# EAGLE schematic AVR_Roller_PCB_7x (EAGLE 8.0.1)
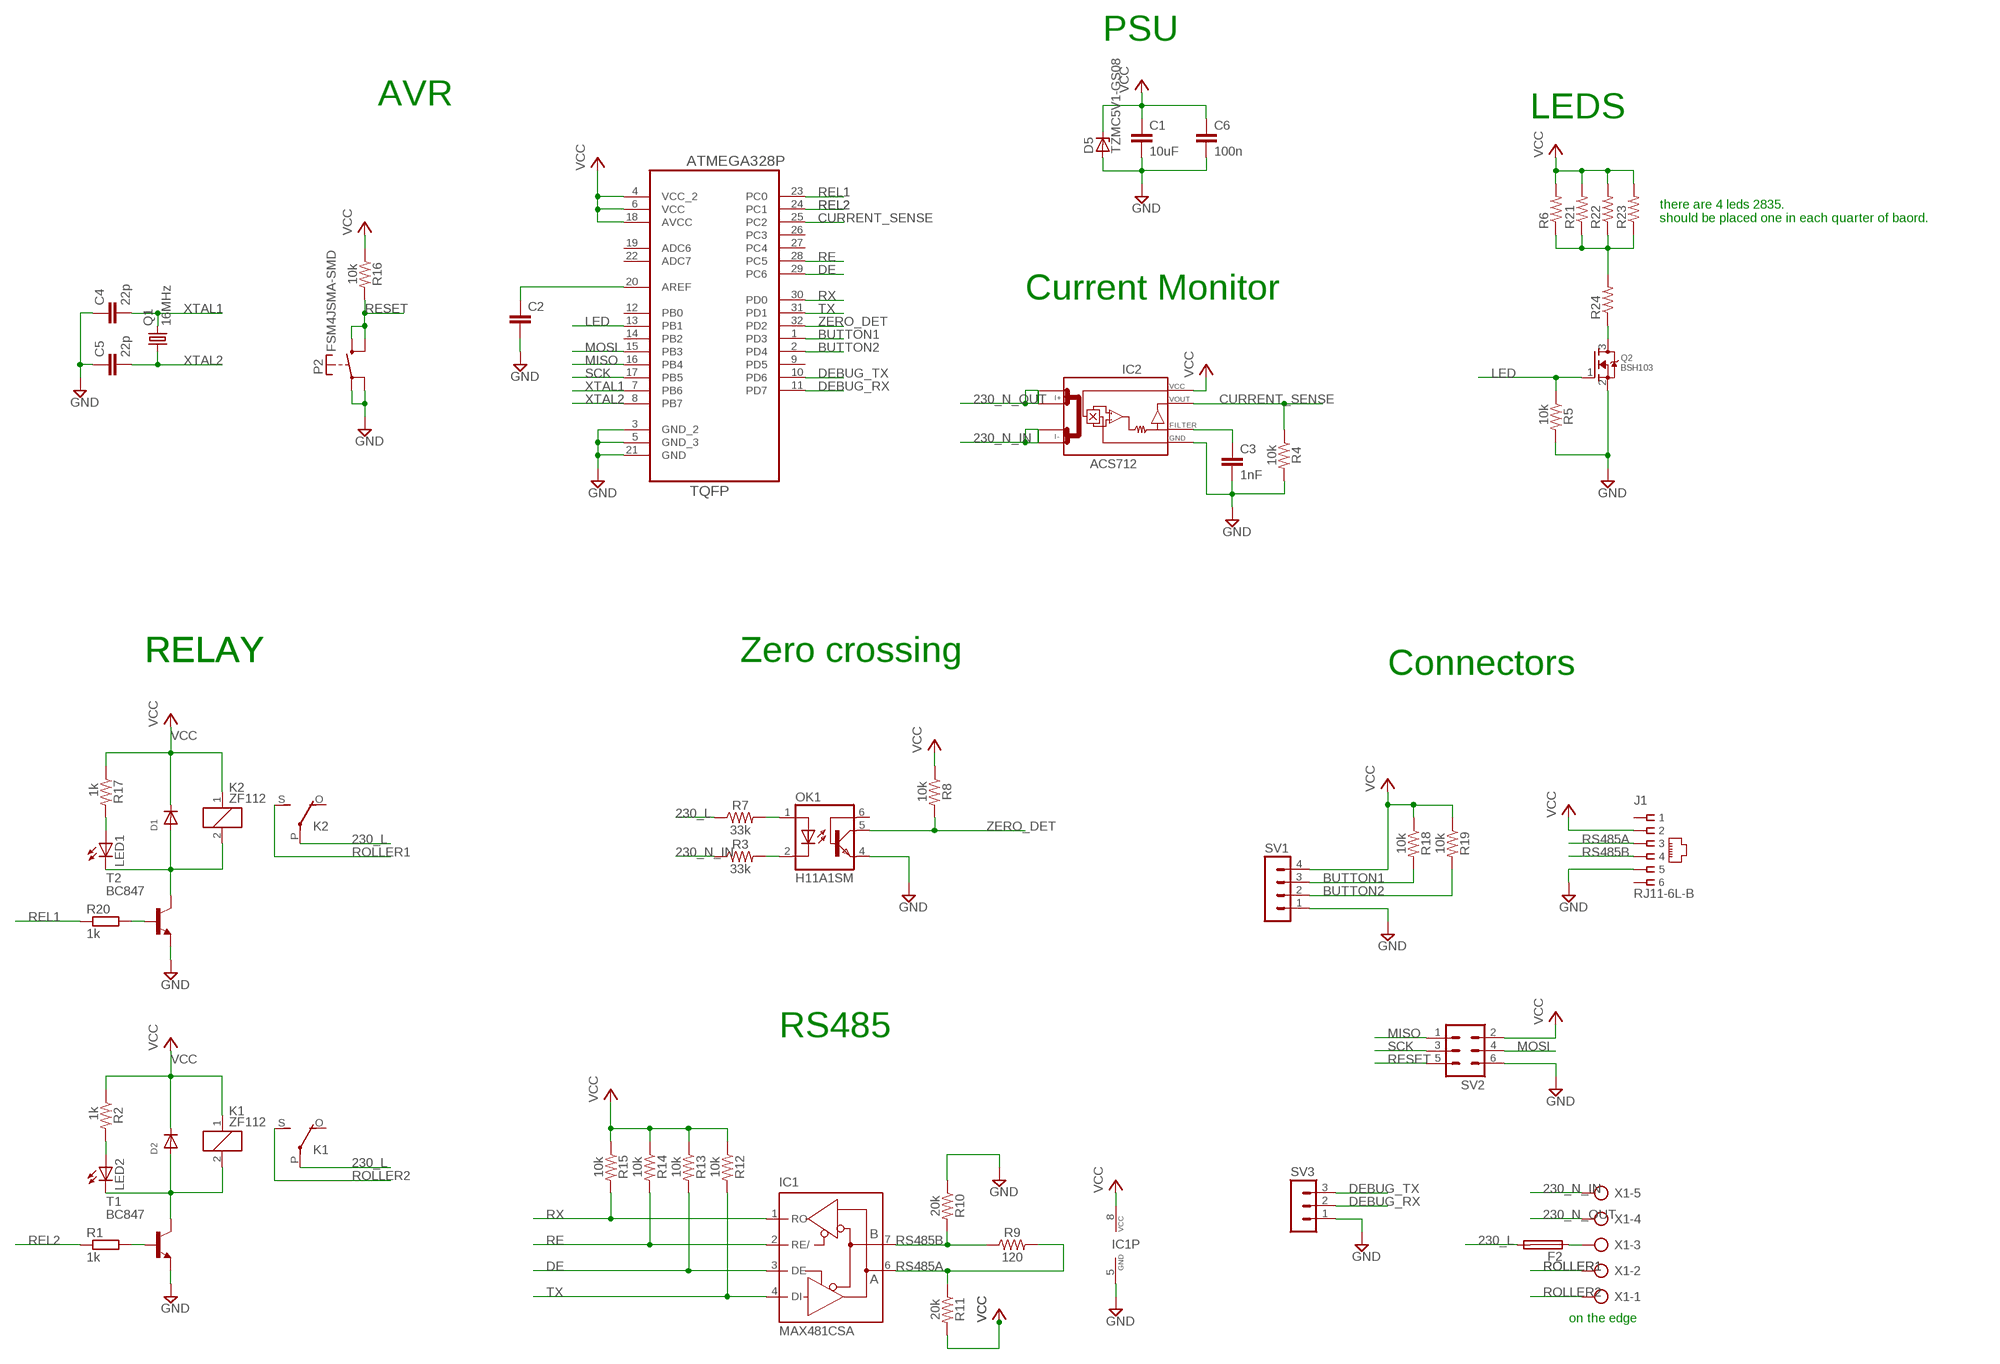
[diagram p0: schematic, sheet 1]

## Parts
C1  10uF  10UF-1206-6.3V-20%  [1206]
C2  C-EUC0805K  [C0805K]
C3  1nF  C-EUC0805K  [C0805K]
C4  22p  C-EUC0805K  [C0805K]
C5  22p  C-EUC0805K  [C0805K]
C6  100n  C-EUC0805K  [C0805K]
D1  DIODE_SOD-123FL  [SOD-123FL]
D2  DIODE_SOD-123FL  [SOD-123FL]
D5  TZMC5V1-GS08  ZENER-DIODESOD80C  [SOD80C]
F2  TE5  [TE5]
IC1  MAX481CSA  [SO08]
IC2  ACS712  [SO08]
J1  RJ11-6L-B  [RJ11-NO_SHIELD]
K1  ZF112  [ZF112]
K2  ZF112  [ZF112]
LED1  LEDCHIPLED_0805  [CHIPLED_0805]
LED2  LEDCHIPLED_0805  [CHIPLED_0805]
OK1  H11A1SM  [DIL6-SMD]
P2  FSM4JSMA-SMD  [FSM4JSMA-SMD]
Q1  16MHz  CSM-7X-DU  [CSM-7X-DU]
Q2  BSH103  MOSFET-NREFLOW  [SOT23]
R1  1k  R-EU_M0805  [M0805]
R2  1k  RESISTOR0805  [0805]
R3  33k  0.1OHM-1210-1/2W-1%  [1210]
R4  10k  RESISTOR0805  [0805]
R5  10k  RESISTOR0805  [0805]
R6  R-US_R1210  [R1210]
R7  33k  0.1OHM-1210-1/2W-1%  [1210]
R8  10k  RESISTOR0805  [0805]
R9  120  RESISTOR0805  [0805]
R10  20k  RESISTOR0805  [0805]
R11  20k  RESISTOR0805  [0805]
R12  10k  RESISTOR0805  [0805]
R13  10k  RESISTOR0805  [0805]
R14  10k  RESISTOR0805  [0805]
R15  10k  RESISTOR0805  [0805]
R16  10k  RESISTOR0805  [0805]
R17  1k  RESISTOR0805  [0805]
R18  10k  RESISTOR0805  [0805]
R19  10k  RESISTOR0805  [0805]
R20  1k  R-EU_M0805  [M0805]
R21  R-US_R1210  [R1210]
R22  R-US_R1210  [R1210]
R23  R-US_R1210  [R1210]
R24  R-US_R1210  [R1210]
SV1  MA04-1  [MA04-1]
SV2  MA03-2  [MA03-2]
SV3  MA03-1  [MA03-1]
T1  BC847  [SOT23]
T2  BC847  [SOT23]
U1  ATMEGA328P-AU  [QFP80P900X900X120-32N]
X1  AK300/5  [AK300/5]

## Nets
230_L: F2.2 K1.P(2:P) K2.P(2:P) R7.1
230_N_IN: IC2.3(I-_0) IC2.4(I-_1) R3.1 X1.5
230_N_OUT: IC2.1(I+_0) IC2.2(I+_1) X1.4
BUTTON1: R18.2 SV1.3 U1.1(PD3)
BUTTON2: R19.2 SV1.2 U1.2(PD4)
CURRENT_SENSE: IC2.7(VOUT) R4.1 U1.25(PC2)
DE: IC1.3(DE) R13.2 U1.29(PC6)
DEBUG_RX: SV3.2 U1.11(PD7)
DEBUG_TX: SV3.3 U1.10(PD6)
GND: C1.2 C2.2 C3.2 C4.1 C5.1 C6.2 D5.A IC1.5(GND) IC2.5(GND) J1.5 OK1.4(EMI) P2.P$1(P) P2.P$2(P) Q2.2(S) R4.2 R5.2 R10.1 SV1.1 SV2.6 SV3.1 T1.2(E) T2.2(E) U1.3(GND_2) U1.5(GND_3) U1.21(GND)
LED: Q2.1(G) R5.1 U1.13(PB1)
MISO: SV2.1 U1.16(PB4)
MOSI: SV2.4 U1.15(PB3)
N$1: LED1.A R17.2
N$2: D2.A K1.2 LED2.C T1.3(C)
N$3: R1.2 T1.1(B)
N$4: LED2.A R2.2
N$5: R20.2 T2.1(B)
N$6: OK1.1(A) R7.2
N$7: OK1.2(C) R3.2
N$8: F2.1 X1.3
N$9: C2.1 U1.20(AREF)
N$10: C3.1 IC2.6(FILTER)
N$11: Q2.3(D) R24.1
N$12: R6.1 R21.1 R22.1 R23.1 R24.2
N$24: D1.A K2.2 LED1.C T2.3(C)
RE: IC1.2(RE/) R14.2 U1.28(PC5)
REL1: R20.1 U1.23(PC0)
REL2: R1.1 U1.24(PC1)
RESET: P2.P$3(S) P2.P$4(S) R16.2 SV2.5
ROLLER1: K2.S(2:S) X1.2
ROLLER2: K1.S(2:S) X1.1
RS485A: IC1.6(A) J1.3 R9.2 R11.1
RS485B: IC1.7(B) J1.4 R9.1 R10.2
RX: IC1.1(RO) R15.2 U1.30(PD0)
SCK: SV2.3 U1.17(PB5)
TX: IC1.4(DI) R12.2 U1.31(PD1)
VCC: C1.1 C6.1 D1.C D2.C D5.C IC1.8(VCC) IC2.8(VCC) J1.2 K1.1 K2.1 R2.1 R6.2 R8.1 R11.2 R12.1 R13.1 R14.1 R15.1 R16.1 R17.1 R18.1 R19.1 R21.2 R22.2 R23.2 SV1.4 SV2.2 U1.4(VCC_2) U1.6(VCC) U1.18(AVCC)
XTAL1: C4.2 Q1.2 U1.7(PB6)
XTAL2: C5.2 Q1.1 U1.8(PB7)
ZERO_DET: OK1.5(COL) R8.2 U1.32(PD2)
Unconnected: J1.1 J1.6 K1.O(2:O) K2.O(2:O) OK1.6(BAS) U1.9(PD5) U1.12(PB0) U1.14(PB2) U1.19(ADC6) U1.22(ADC7) U1.26(PC3) U1.27(PC4)

## Notes on the sheet
- PSU
- AVR
- LEDS
- there are 4 leds 2835.
  should be placed one in each quarter of baord.
- Current Monitor
- RELAY | RELAY | RELAY | Zero crossing
- Connectors
- RS485
- on the edge

## Library data of the parts
C1 = SparkFun-Capacitors:10UF: 10.0µF ceramic capacitors A capacitor is a passive two-terminal electrical component used to store electrical energy temporarily in an electric field.; PROD_ID: CAP-10057
C2-C6 = rcl:C-EU: CAPACITOR, European symbol
D1 D2 = adafruit@1:DIODE: Diode SMADIODE - SMA Surface Mount Package 20V 1A Schottky Diode Digikey: 641-1014-6-ND DO-1N4148 - Through Hole Small Current Diode SOD-123 20V 1 A (.5mV Vf) Schottky Diode - Digikey: MBRX120TPMSCT-ND SOD-323 10V 570mA (.38mV Vf, 3ns) Schottky Diode - Digikey: ZLLS410CT-ND SOD-523 30V 30mA Schottky Diode (RB751S-40TE61) - Digikey: RB751S-40TE61CT-ND SOT23-R/W - SOT23 Package (R = Solder Paste/Reflow Ovens, W = Hand-Soldering) BAT54Film 40V 300mA - Digikey: 497-7162-1-ND
D5 = diode:ZENER-DIODE: Z-Diode
F2 = fuse:TE5: FUSE Wickmann; OC_FARNELL: unknown; OC_NEWARK: unknown
IC1 = maxim:MAX481CSA: RS485 TRANSEIVER; MF: MAXIM; MPN: MAX481CSA; OC_FARNELL: unknown; OC_NEWARK: 90C3817
IC2 = ACS712:ACS712
J1 = con-tycoelectronics:RJ11: CORCOM Modular RJ Jacks No Shield Source: www.tycoelectronics.com .. ENG_DS_1654001_1099_RJ_L_0507.pdf; MF: TYCO ELECTRONICS; MPN: RJ11-6L-B; OC_FARNELL: unknown; OC_NEWARK: 52K3613
K1 K2 = relay:ZF112: RELAY 1 x switch; OC_FARNELL: unknown; OC_NEWARK: unknown
LED1 LED2 = adafruit:LED: LED OSRAM: - CHIPLED LG R971, LG N971, LY N971, LG Q971, LY Q971, LO R971, LY R971 LH N974, LH R974 LS Q976, LO Q976, LY Q976 LO Q996 - Hyper CHIPLED LW Q18S LB Q993, LB Q99A, LB R99A - SideLED LS A670, LO A670, LY A670, LG A670, LP A670 LB A673, LV A673, LT A673, LW A673 LH A674 LY A675 LS A676, LA A676, LO A676, LY A676, LW A676 LS A679, LY A679, LG A679 - Hyper Micro SIDELED® LS Y876, LA Y876, LO Y876, LY Y876 LT Y87S - SmartLED LW L88C, LW L88S LB L89C, LB L89S, LG L890 LS L89K, LO L89K, LY L89K LS L896, LA L896, LO L896, LY L896 - TOPLED LS T670, LO T670, LY T670, LG T670, LP T670 LSG T670, LSP T670, LSY T670, LOP T670, LYG T670 LG T671, LOG T671, LSG T671 LB T673, LV T673, LT T673, LW T673 LH T674 LS T676, LA T676, LO T676, LY T676, LB T676, LH T676, LSB T676, LW T676 LB T67C, LV T67C, LT T67C, LS T67K, LO T67K, LY T67K, LW E67C LS E67B, LA E67B, LO E67B, LY E67B, LB E67C, LV E67C, LT E67C LW T67C LS T679, LY T679, LG T679 LS T770, LO T770, LY T770, LG T770, LP T770 LB T773, LV T773, LT T773, LW T773 LH T774 LS E675, LA E675, LY E675, LS T675 LS T776, LA T776, LO T776, LY T776, LB T776 LHGB T686 LT T68C, LB T68C - Hyper Mini TOPLED® LB M676 - Mini TOPLED Santana® LG M470 LS M47K, LO M47K, LY M47K Source: http://www.osram.convergy.de/
OK1 = optocoupler:H11A*?M: General Purpose 6-Pin Phototransistor Optocouplers Source: http://www.fairchildsemi.com/ds/4N/4N35-M.pdf; OC_FARNELL: unknown; OC_NEWARK: unknown
P2 = switch-misc:FSM4JSMA-SMD: TYCO SWITCH
Q1 = crystal:CSM-7X-DU: SMD CRYSTAL Source: www.ecsxtal.com .. Crystal 3.6864MHz CSM_7X_DU.PDF; OC_FARNELL: unknown; OC_NEWARK: unknown
Q2 = adafruit:MOSFET-N: N-Channel Mosfet 2N7002E - 60V 260mA SOT23 [Digikey: 2N7002ET1GOSTR-ND] - REEL BSH103 - 30V 850mA SOT23 [Digikey: 568-5013-1-ND]
R1 R20 = resistor:R-EU_: RESISTOR, European symbol
R2 R4 R5 R8-R19 = SparkFun-Resistors:RESISTOR: Generic Resistor Package
R3 R7 = SparkFun-Resistors:0.1OHM: 0.1Ω resistor A resistor is a passive two-terminal electrical component that implements electrical resistance as a circuit element. Resistors act to reduce current flow, and, at the same time, act to lower voltage levels within circuits. - Wikipedia; PROD_ID: RES-12374; VALUE: 0.1
R6 R21-R24 = adafruit:R-US_: RESISTOR, American symbol
SV1 = con-lstb:MA04-1: PIN HEADER; OC_FARNELL: unknown; OC_NEWARK: unknown
SV2 = con-lstb:MA03-2: PIN HEADER; OC_FARNELL: unknown; OC_NEWARK: unknown
SV3 = con-lstb:MA03-1: PIN HEADER; OC_FARNELL: unknown; OC_NEWARK: unknown
T1 T2 = transistor:BC847: NPN TRANSISTOR
U1 = Ava:ATMEGA328P-AU; DESCRIPTION: 8-bit Microcontroller with In-System Programmable Flash; MPN: ATMEGA328P-AU; OC_FARNELL: 1715486; OC_NEWARK: 14R4631; PACKAGE: TQFP-32; SUPPLIER: Atmel
X1 = con-ptr500:AK300/5: CONNECTOR; OC_FARNELL: unknown; OC_NEWARK: unknown